# EAGLE design DA_Finale_Version (EAGLE 9.0.1)
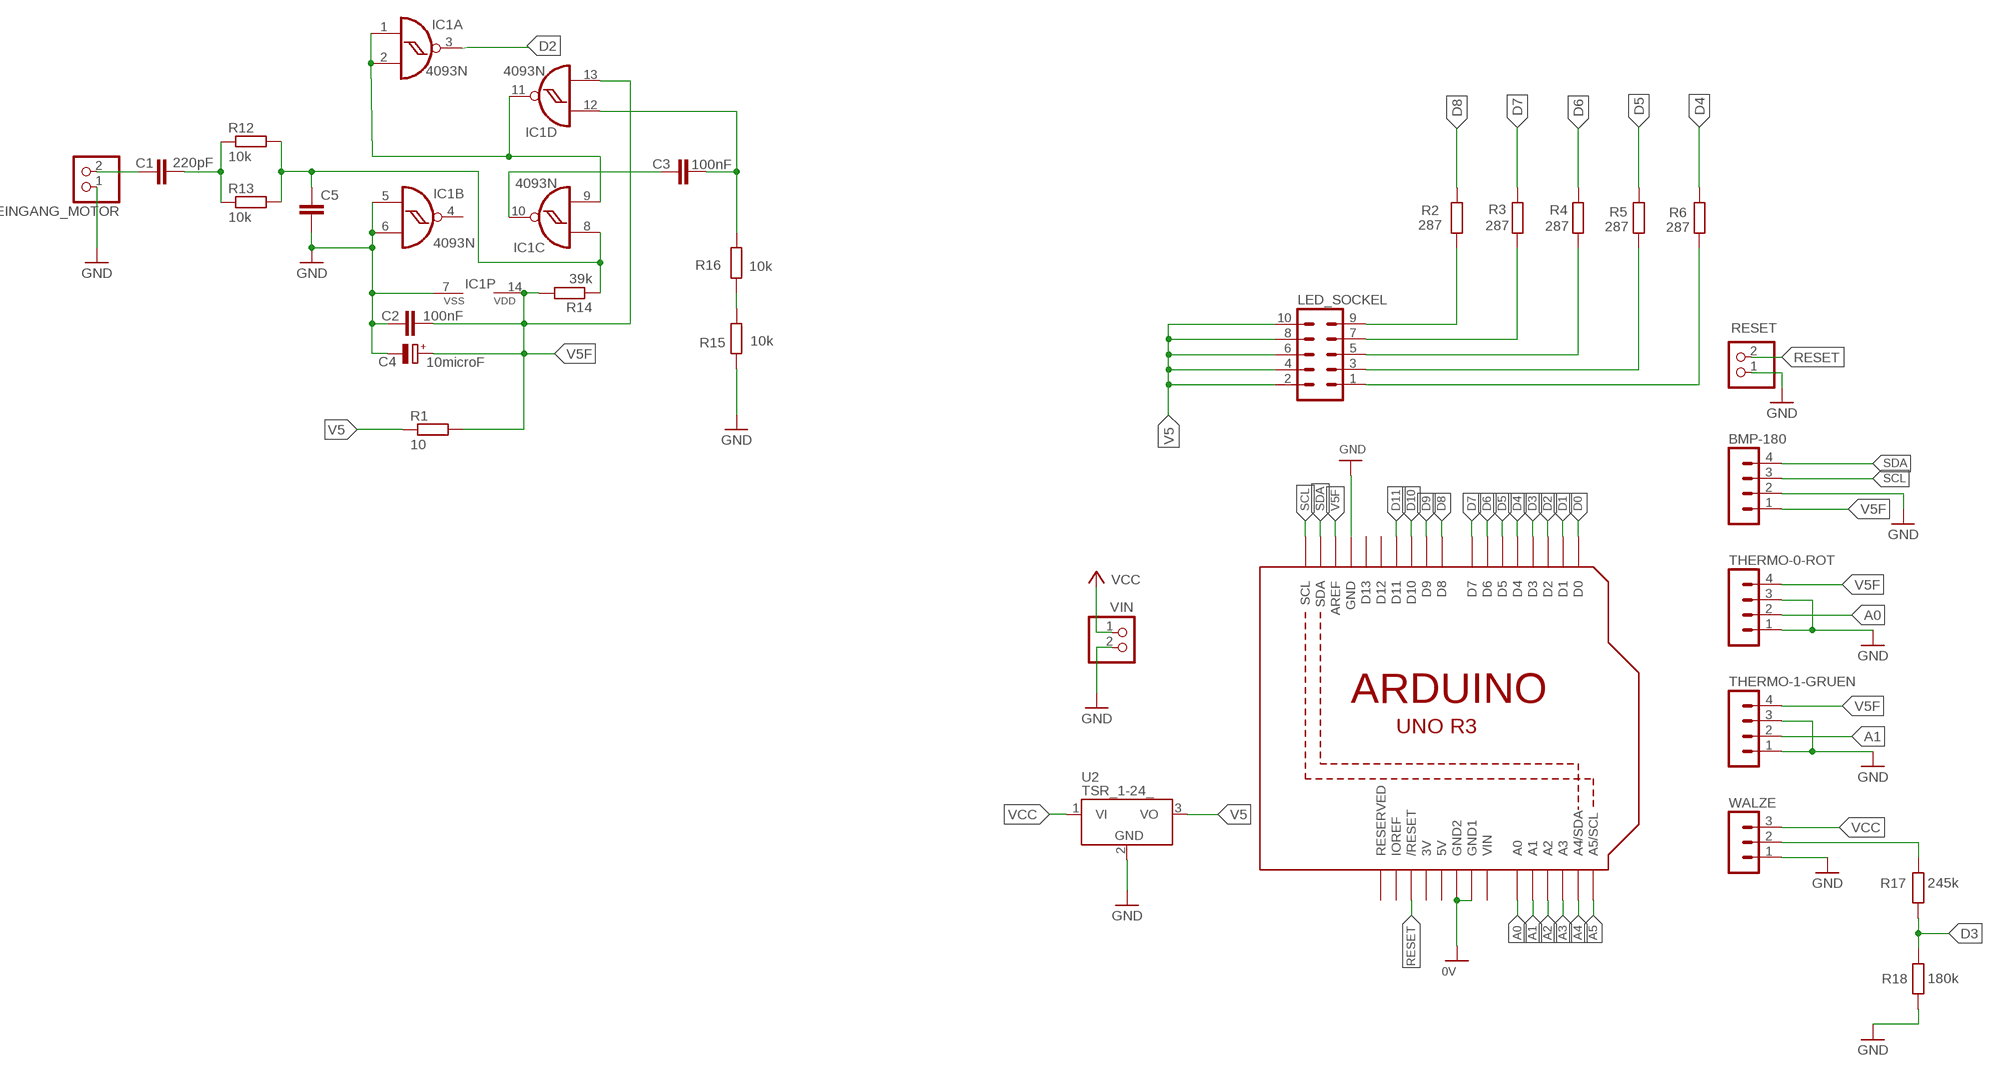
[diagram p0: schematic, sheet 1]

## Parts
BMP-180  MA04-1  [MA04-1]
C1  220pF  C-EU050-025X075  [C050-025X075]
C2  100nF  C-EU050-025X075  [C050-025X075]
C3  100nF  C-EU050-025X075  [C050-025X075]
C4  10microF  CPOL-EUE3.5-8  [E3,5-8]
C5  C-EU050-025X075  [C050-025X075]
EINGANG_MOTOR  PINHD-1X2  [1X02]
IC1  4093N  [DIL14]
LED_SOCKEL  MA05-2  [MA05-2]
R1  10  R-EU_0207/7  [0207/7]
R2  287  R-EU_0207/10  [0207/10]
R3  287  R-EU_0207/10  [0207/10]
R4  287  R-EU_0207/10  [0207/10]
R5  287  R-EU_0207/10  [0207/10]
R6  287  R-EU_0207/10  [0207/10]
R12  10k  R-EU_0207/7  [0207/7]
R13  10k  R-EU_0207/7  [0207/7]
R14  39k  R-EU_0207/7  [0207/7]
R15  10k  R-EU_0207/7  [0207/7]
R16  10k  R-EU_0207/7  [0207/7]
R17  245k  R-EU_0207/7  [0207/7]
R18  180k  R-EU_0207/7  [0207/7]
RESET  PINHD-1X2  [1X02]
THERMO-0-ROT  MA04-1  [MA04-1]
THERMO-1-GRUEN  MA04-1  [MA04-1]
U1  ARDUINOR3-BPLACE  [ARDUINOR3-BPLACE]
U2  TSR_1-24_  [TSR-1]
VIN  PINHD-1X2  [1X02]
WALZE  MA03-1  [MA03-1]

## Nets
A0: THERMO-0-ROT.2 U1.A0
A1: THERMO-1-GRUEN.2 U1.A1
A2: U1.A2
A3: U1.A3
A4: U1.A4(A4/SDA)
A5: U1.A5(A5/SCL)
D0: U1.D0
D1: U1.D1
D2: IC1.3(A:O) U1.D2
D3: R17.1 R18.2 U1.D3
D4: R6.2 U1.D4
D5: R5.2 U1.D5
D6: R4.2 U1.D6
D7: R3.2 U1.D7
D8: R2.2 U1.D8
D9: U1.D9
D10: U1.D10
D11: U1.D11
GND: BMP-180.2 C2.1 C4.- C5.2 EINGANG_MOTOR.1 IC1.5(B:I0) IC1.6(B:I1) IC1.7(P:VSS) R15.1 R18.1 RESET.1 THERMO-0-ROT.1 THERMO-0-ROT.3 THERMO-1-GRUEN.1 THERMO-1-GRUEN.3 U1.GND U1.GND1 U1.GND2 U2.2(GND) VIN.2 WALZE.1 ; supply symbol labelled 0V
N$1: LED_SOCKEL.9 R2.1
N$2: LED_SOCKEL.7 R3.1
N$3: LED_SOCKEL.5 R4.1
N$4: LED_SOCKEL.3 R5.1
N$5: LED_SOCKEL.1 R6.1
N$6: C1.1 EINGANG_MOTOR.2
N$7: C1.2 R12.1 R13.1
N$10: C3.1 IC1.12(D:I0) R16.2
N$11: IC1.1(A:I0) IC1.2(A:I1) IC1.9(C:I1) IC1.11(D:O)
N$12: R17.2 WALZE.2
N$14: C5.1 IC1.8(C:I0) R12.2 R13.2 R14.1
N$16: R15.2 R16.1
N$19: C3.2 IC1.10(C:O)
RESET: RESET.2 U1.RESET(/RESET)
SCL: BMP-180.3 U1.SCL
SDA: BMP-180.4 U1.SDA
V5: LED_SOCKEL.2 LED_SOCKEL.4 LED_SOCKEL.6 LED_SOCKEL.8 LED_SOCKEL.10 R1.1 U2.3(VO)
V5F: BMP-180.1 C2.2 C4.+ IC1.13(D:I1) IC1.14(P:VDD) R1.2 R14.2 THERMO-0-ROT.4 THERMO-1-GRUEN.4 U1.AREF
VCC: U2.1(VI) VIN.1 WALZE.3
Unconnected: IC1.4(B:O) U1.D12 U1.D13 U1.IOREF U1.RESERVED

## Power pins joined to a net without a drawn wire
3V: U1.3V
5V: U1.5V
VIN: U1.VIN

## Library data of the parts
BMP-180 THERMO-0-ROT THERMO-1-GRUEN = con-lstb:MA04-1: PIN HEADER; OC_FARNELL: unknown; OC_NEWARK: unknown
C1-C3 C5 = rcl:C-EU: CAPACITOR, European symbol; SPICEPREFIX: C
C4 = rcl:CPOL-EU: POLARIZED CAPACITOR, European symbol; SPICEPREFIX: C
EINGANG_MOTOR RESET VIN = pinhead:PINHD-1X2: PIN HEADER
IC1 = 40xx:4093: Quad 2-input NAND schmitt trigger
LED_SOCKEL = con-lstb:MA05-2: PIN HEADER; OC_FARNELL: unknown; OC_NEWARK: unknown
R1-R6 = rcl:R-EU_: RESISTOR, European symbol; SPICEPREFIX: R
R12-R18 = resistor:R-EU_: RESISTOR, European symbol
U1 = adafruit:ARDUINOR3: This is a new object for the new Arduino R3 - with extra pins that you may want to use (such as IOref, and duplicated A4/A5
U2 = _traco_tsr-1:TSR_1-*: TRACO TSR-1 Series Point-of-Load DC/DC-Converters Vi max. 36 V; Vo = (1.2 .. 15)V ±2%; Io = 0 .. 1 A SIP-Package (drop-in replacement for 78xx linear voltage regulators in TO220-package, vertically assembled) Source: www.tracopower.com Technologies: TSR 1- Vi (V) Vo (V) ±2% Io = 0 .. 1 A 24_ ( generic ) 2412 4.6 .. 36 1.2 2415 4.6 .. 36 1.5 2418 4.6 .. 36 1.8 2425 4.6 .. 36 2.5 2433 4.75.. 36 3.3 2450 6.5 .. 36 5.0 2465 9.0 .. 36 6.5 2490 12 .. 36 9.0 24120 15 .. 36 12 24150 18 .. 36 15 Author: Dipl.-Ing. FH Rainer Bayer HHN Hochschule Heilbronn, rainer.bayer@hs-heilbronn.de Ingenieurbüro ing-rb, mail@ing-rb.de
WALZE = con-lstb:MA03-1: PIN HEADER; OC_FARNELL: unknown; OC_NEWARK: unknown

## Board
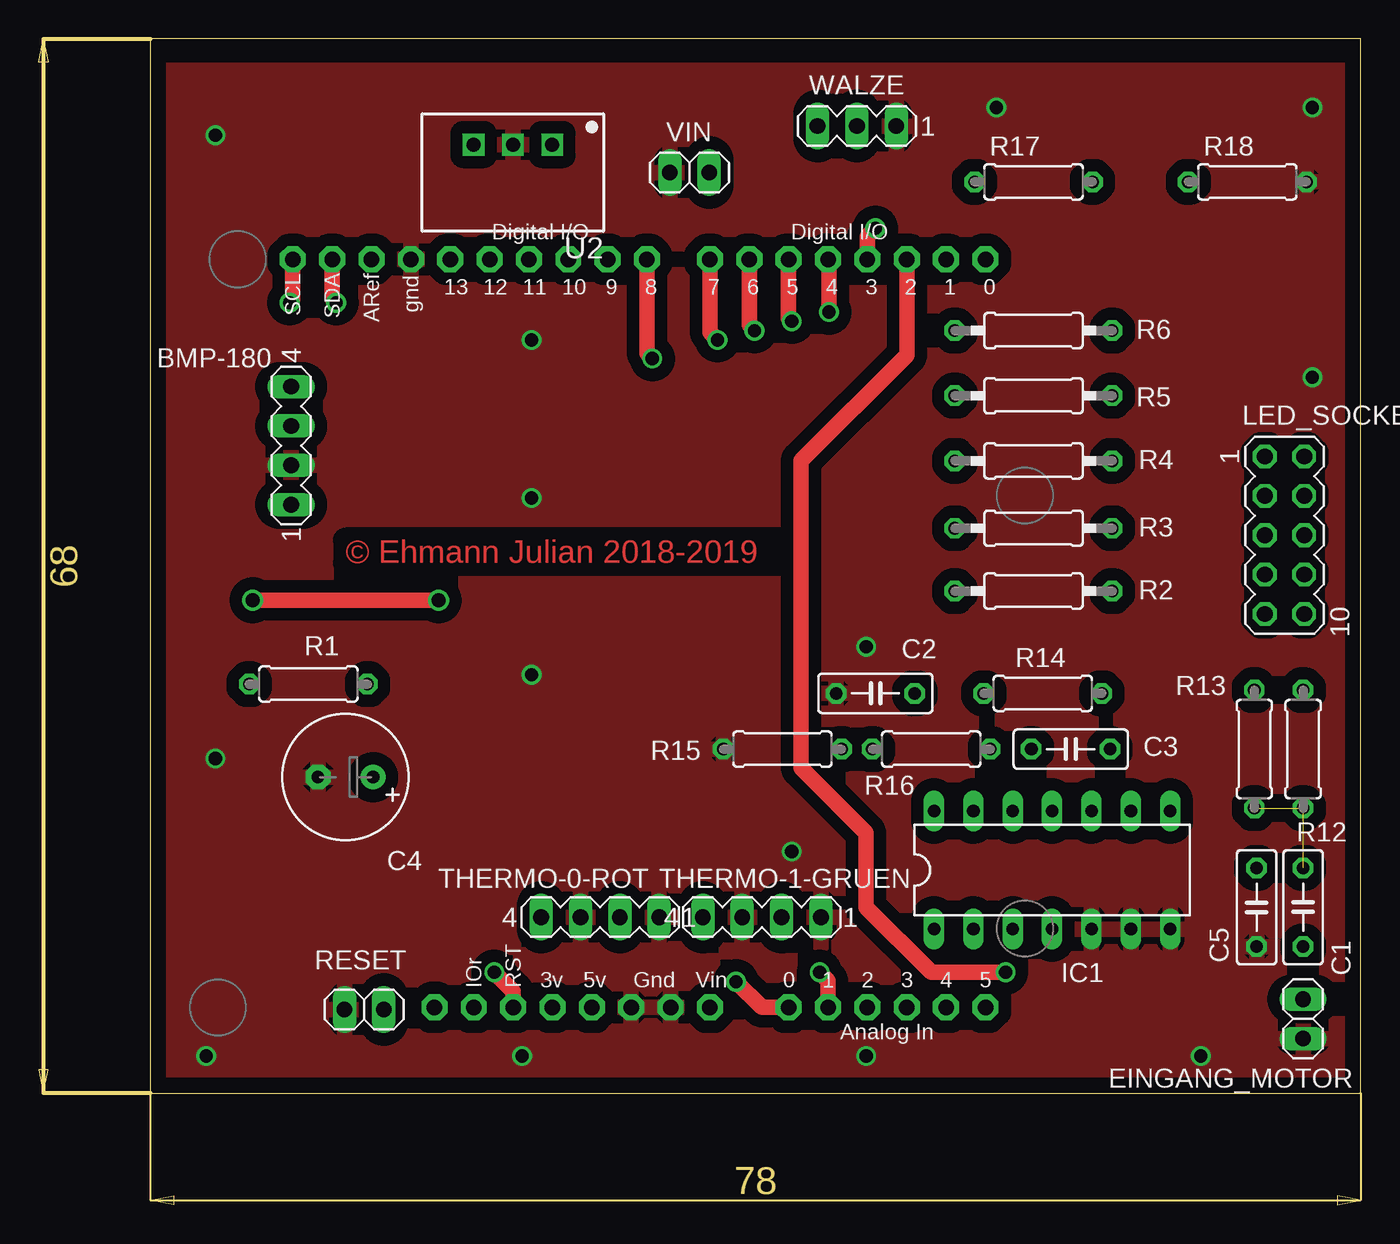
[diagram p1: board, top side]
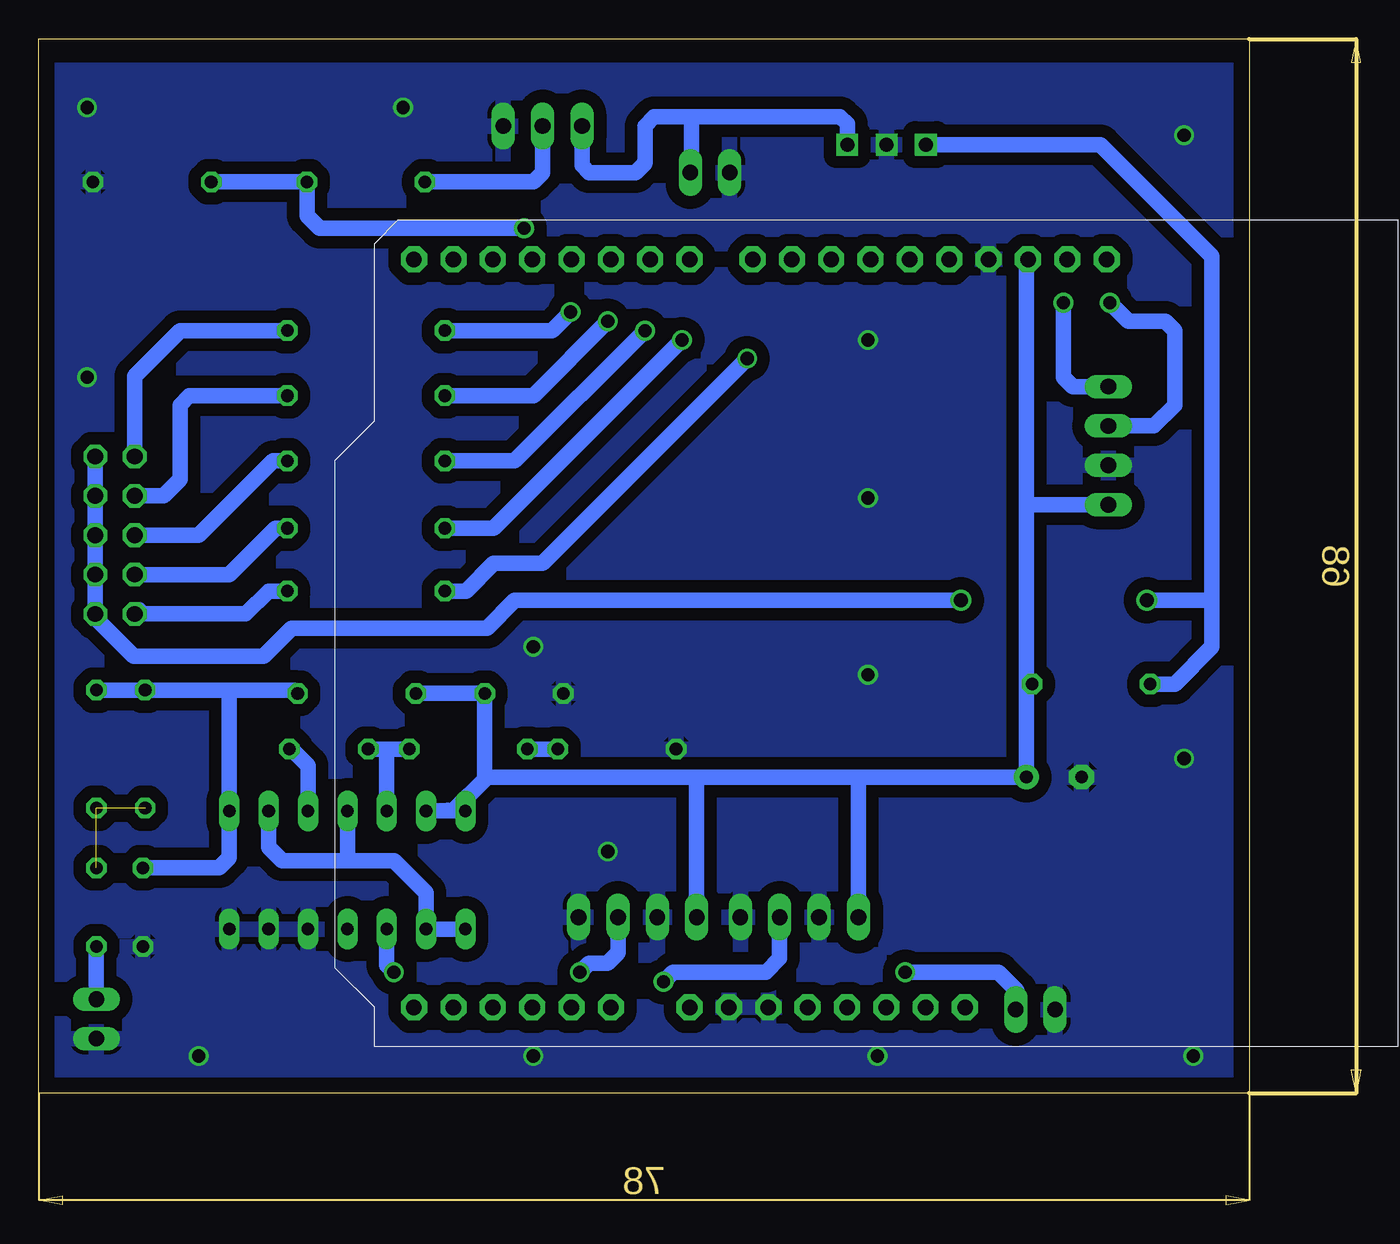
[diagram p2: board, bottom side, seen from below]

Size 78.12 x 68.03 mm. Coordinates in mm from the lower left corner, seen from the top.
Outline: 0,0 78.12,0 78.12,68.03 0,68.03 0,0
Copper layers (1*16): Top 0.035mm / dielectric 1.5mm / Bottom 0.035mm
Design rules "default": minimum track width 6mil, minimum drill 0.35mm, track to track 6mil, track to pad 6mil, pad to pad 6mil, via to via 6mil, smd to smd 6mil, copper to edge 40mil, drill to drill 6mil, minimum pad ring 10mil, minimum via ring 8mil, stop-mask expansion 4mil, vias tented up to drill 0mil, thermal gap 10mil

### Footprints (pad centres in the part's own frame; a part is rotated, then mirrored left to right if it is on the bottom)
MA04-1 = drill 1.016 long: 1 -3.81,0; 2 -1.27,0; 3 1.27,0; 4 3.81,0
C050-025X075 = drill 0.813 octagon: 1 -2.54,0; 2 2.54,0
E3,5-8 = drill 0.813 pad 1.6: + -1.778,0 | drill 0.813 pad 1.6 octagon: - 1.778,0
1X02 = drill 1.016 long: 1 -1.27,0; 2 1.27,0
DIL14 = drill 0.813 long: 1 -7.62,-3.81; 2 -5.08,-3.81; 3 -2.54,-3.81; 4 0,-3.81; 5 2.54,-3.81; 6 5.08,-3.81; 7 7.62,-3.81; 8 7.62,3.81; 9 5.08,3.81; 10 2.54,3.81; 11 0,3.81; 12 -2.54,3.81; 13 -5.08,3.81; 14 -7.62,3.81
MA05-2 = drill 1.016 octagon: 1 -5.08,-1.27; 2 -5.08,1.27; 3 -2.54,-1.27; 4 -2.54,1.27; 5 0,-1.27; 6 0,1.27; 7 2.54,-1.27; 8 2.54,1.27; 9 5.08,-1.27; 10 5.08,1.27
0207/7 = drill 0.813 octagon: 1 -3.81,0; 2 3.81,0
0207/10 = drill 0.813 octagon: 1 -5.08,0; 2 5.08,0
ARDUINOR3-BPLACE = drill 1 pad 1.676 octagon: 3V 35.56,2.54; 5V 38.1,2.54; A0 50.8,2.54; A1 53.34,2.54; A2 55.88,2.54; A3 58.42,2.54; A4 60.96,2.54; A5 63.5,2.54; AREF 23.876,50.8; D0 63.5,50.8; D1 60.96,50.8; D2 58.42,50.8; D3 55.88,50.8; D4 53.34,50.8; D5 50.8,50.8; D6 48.26,50.8; D7 45.72,50.8; D8 41.656,50.8; D9 39.116,50.8; D10 36.576,50.8; D11 34.036,50.8; D12 31.496,50.8; D13 28.956,50.8; GND 26.416,50.8; GND1 43.18,2.54; GND2 40.64,2.54; IOREF 30.48,2.54; RESERVED 27.94,2.54; RESET 33.02,2.54; SCL 18.796,50.8; SDA 21.336,50.8; VIN 45.72,2.54
TSR-1 = drill 0.9 square: 1 -2.54,0; 2 0,0; 3 2.54,0
MA03-1 = drill 1.016 long: 1 -2.54,0; 2 0,0; 3 2.54,0

### Placement (x,y rotation side)
BMP-180  9.09,41.78 90 top
C1  74.4,12 90 top
C2  46.8,25.8 0 top
C3  59.4,22.2 0 top
C4  12.6,20.4 180 top
C5  71.4,12 270 top
EINGANG_MOTOR  74.4,4.8 90 top
IC1  58.2,14.4 0 top
LED_SOCKEL  73.2,36 270 top
R1  10.2,26.4 0 top
R2  57,32.4 180 top
R3  57,36.45 180 top
R4  57,40.8 180 top
R5  57,45 180 top
R6  57,49.2 180 top
R12  74.4,22.2 90 top
R13  71.25,22.2 90 top
R14  57.6,25.8 180 top
R15  40.8,22.2 0 top
R16  50.4,22.2 0 top
R17  57,58.8 180 top
R18  70.8,58.8 180 top
RESET  13.8,5.4 0 top
THERMO-0-ROT  29.03,11.36 180 top
THERMO-1-GRUEN  39.47,11.36 180 top
U1  -9.6,3 0 top
U2  23.4,61.2 180 top
VIN  34.8,59.4 180 top
WALZE  45.6,62.4 180 top

### Tracks (layer width: path | path; a pad name or v marks a point on that pad's centre or on a via)
A0  (via drill 0.85 pad 0.85)
  Top 1: U1.A0 39.46,5.54 v37.8,7.2
  Bottom 1: v37.8,7.2 37.2,7.8 31.2,7.8 30.3,8.7 THERMO-0-ROT.2
A1  (via drill 0.85 pad 0.85)
  Top 1: U1.A1 43.74,7.26 v43.2,7.8
  Bottom 1: v43.2,7.8 42.6,8.4 41.4,8.4 40.74,9.06 THERMO-1-GRUEN.2
D2  (via drill 0.85 pad 0.85)
  Top 1: U1.D2 48.82,47.62 42,40.8 42,21 46.2,16.8 46.2,12 50.4,7.8 v55.2,7.8
  Bottom 1: v55.2,7.8 55.66,8.26 IC1.3
D3  (via drill 0.85 pad 0.85)
  Top 1: U1.D3 46.28,55.28 v46.8,55.8
  Bottom 1: R18.2 R17.1 60.81,56.61 60,55.8 v46.8,55.8
D4  (via drill 0.85 pad 0.85)
  Top 1: U1.D4 43.8,53.74 v43.8,50.4
  Bottom 1: v43.8,50.4 45,49.2 R6.2
D5  (via drill 0.85 pad 0.85)
  Top 1: U1.D5 41.2,50 v41.4,49.8
  Bottom 1: R5.2 46.2,45 v41.4,49.8
D6  (via drill 0.85 pad 0.85)
  Top 1: U1.D6 38.66,49.54 v39,49.2
  Bottom 1: R4.2 47.4,40.8 v39,49.2
D7  (via drill 0.85 pad 0.85)
  Top 1: U1.D7 36.12,49.08 v36.6,48.6
  Bottom 1: v36.6,48.6 48.75,36.45 R3.2
D8  (via drill 0.85 pad 0.85)
  Top 1: U1.D8 32.06,47.74 v32.4,47.4
  Bottom 1: R2.2 50.55,32.4 48.75,34.2 45.6,34.2 v32.4,47.4
GND  (via drill 0.85 pad 0.85)
  other vias: 4.2,61.8 4.2,21.6 3.6,2.4 24,2.4 46.2,2.4 67.8,2.4 24.6,27 24.6,38.4 24.6,48.6 54.6,63.6 75,63.6 75,46.2 46.2,28.8 41.4,15.6
  pour Bottom (isolate 0.813): 0,66 0,0 78,0 78,66
  pour Top (isolate 0.813): 0,66 0,0 78,0 78,66
N$1
  Bottom 1: 71.65,31.2 LED_SOCKEL.9 64.76,30.92 63.28,32.4 R2.1
N$2
  Bottom 1: LED_SOCKEL.7 65.82,33.46 62.83,36.45 R3.1
N$3
  Bottom 1: LED_SOCKEL.5 67.8,36 63,40.8 R4.1
N$4
  Bottom 1: R5.1 68.4,45 69,44.4 69,39.6 70.06,38.54 LED_SOCKEL.3
N$5
  Bottom 1: R6.1 69,49.2 71.93,46.27 LED_SOCKEL.1
N$6
  Bottom 1: C1.1 EINGANG_MOTOR.2
N$7  (2 unrouted)
N$10
  Bottom 1: R16.2 55.8,22.2 | 55.8,22.2 C3.1 | IC1.12 55.66,22.06 55.8,22.2
N$11
  Bottom 1: IC1.1 IC1.2 53.12,12.92 55.2,15 58.2,15 | IC1.9 63.28,15.88 62.4,15 58.2,15 | IC1.11 58.2,15
N$12
  Bottom 1: R17.2 46.2,58.8 45.6,59.4 WALZE.2
N$14
  Bottom 1: R12.2 R13.2 65.7,26.01 | C5.1 66.46,14.54 65.82,15.18 IC1.8 65.82,25.89 65.7,26.01 | R14.1 61.62,26.01 65.7,26.01
N$16
  Bottom 1: R15.2 R16.1
N$19
  Bottom 1: IC1.10 60.74,21.14 61.8,22.2 C3.2
RESET  (via drill 0.85 pad 0.85)
  Top 1: U1.RESET 23.42,6.58 v22.2,7.8
  Bottom 1: RESET.2 arc-45 15,5.57 15,6.6 16.2,7.8 v22.2,7.8
SCL  (via drill 0.85)
  Top 1: U1.SCL 9.2,51.2 v9,51
  Bottom 1: BMP-180.3 6.15,43.05 4.8,44.4 4.8,49.2 5.4,49.8 7.8,49.8 v9,51
SDA  (via drill 0.85)
  Top 1: U1.SDA 11.74,51.26 v12,51
  Bottom 1: BMP-180.4 11.39,45.59 12,46.2 v12,51
V5  (via drill 0.9)
  Top 1: v18.6,31.8 v6.6,31.8
  Bottom 1: LED_SOCKEL.2 LED_SOCKEL.4 LED_SOCKEL.6 LED_SOCKEL.8 LED_SOCKEL.10 74.47,30.67 72,28.2 63.6,28.2 61.8,30 49.2,30 47.4,31.8 v18.6,31.8 | R1.1 4.8,26.4 2.4,28.8 2.4,31.8 | U2.3 9.6,61.2 2.4,54 2.4,31.8 | v6.6,31.8 2.4,31.8
V5F
  Bottom 1: IC1.14 51.74,18.25 | IC1.14 51.39,18.21 49.2,20.4 | IC1.14 IC1.13 | R14.2 C2.2 49.34,20.54 49.2,20.4 | 25.2,20.4 C4.+ 14.38,26.03 | 25.2,20.4 35.4,20.4 | 35.4,20.4 49.2,20.4 | THERMO-0-ROT.4 25.22,20.38 25.2,20.4 | THERMO-1-GRUEN.4 35.66,20.14 35.4,20.4 | 14.38,26.03 R1.2 | 14.38,37.8 14.38,26.03 | U1.AREF 14.38,53.7 14.38,37.8 | BMP-180.1 14.21,37.97 14.38,37.8
VCC
  Bottom 1: WALZE.3 43.06,59.86 42.6,59.4 39.6,59.4 39,60 39,62.4 38.4,63 36,63 | VIN.1 36,59.47 36,63 | U2.1 25.94,62.54 26.4,63 36,63

### Text on the board
Top: © Ehmann Julian 2018-2019